# Altium schematic sheet VESC6.SchDoc
size A4; SheetNumber: 1; SheetTotal: 8
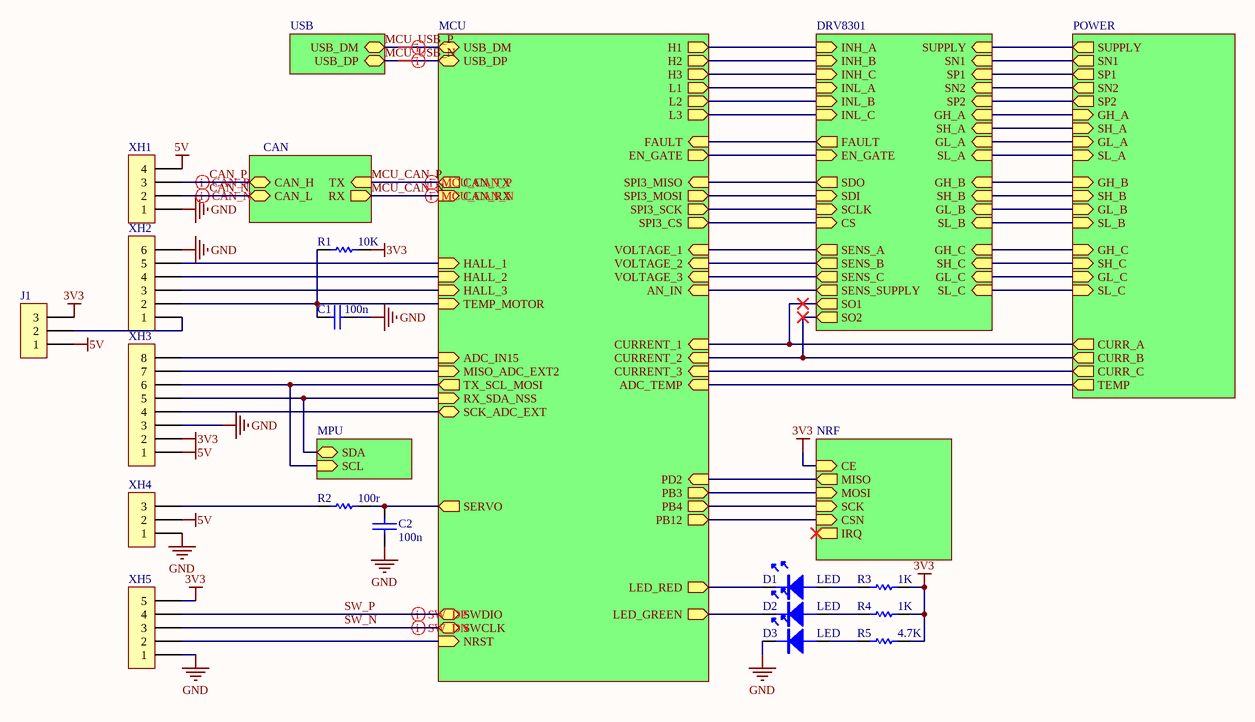
[diagram p0: VESC6.SchDoc]

## Parts
C1  100n  [0603C]
C2  100n  [0603C]
D1  LED  [LED-0603Y]
D2  LED  [LED-0603Y]
D3  LED  [LED-0603Y]
J1  Pin HDR1X3  [Pin HDR1X3/2.54mm-S]  (value not drawn)
R1  10K  [0603R]
R2  100r  [0603R]
R3  1K  [0603R]
R4  1K  [0603R]
R5  4.7K  [0603R]
XH1  XH4  [XH4/2.54mm/90]  (value not drawn)
XH2  XH6  [XH6/2.54mm/90]  (value not drawn)
XH3  XH8  [XH8/2.54mm/90]  (value not drawn)
XH4  XH3  [XH3/2.54mm/90]  (value not drawn)
XH5  XH5  [XH5/2.54mm/90]  (value not drawn)

## Sub-sheets
CAN = can: TX (in), RX (out), CAN_H (bidir), CAN_L (bidir)
DRV8301 = drv8301.SchDoc: INH_A (in), INH_B (in), INH_C (in), INL_A (in), INL_B (in), INL_C (in), FAULT (out), EN_GATE (in), SDO (out), SDI (in), SCLK (in), CS (in), SENS_A (out), SENS_B (out), SENS_C (out), SENS_SUPPLY (out), SUPPLY (in), GH_A (in), SH_A (in), GL_A (in), SL_A (in), GH_B (in), SH_B (in), GL_B (in), SL_B (in), GH_C (in), SH_C (in), GL_C (in), SL_C (in), SN1 (in), SN2 (in), SP1 (in), SP2 (in), SO1 (out), SO2 (out)
MCU = MCU.SchDoc: H1 (out), H2 (out), H3 (out), L1 (out), L2 (out), L3 (out), FAULT (in), EN_GATE (out), SPI3_MISO (in), SPI3_MOSI (out), SPI3_SCK (out), SPI3_CS (out), VOLTAGE_1 (in), VOLTAGE_2 (in), VOLTAGE_3 (in), AN_IN (in), CURRENT_1 (in), CURRENT_2 (in), CURRENT_3 (in), ADC_TEMP (in), PD2 (in), PB3 (out), PB4 (out), PB12 (out), LED_RED (out), LED_GREEN (out), USB_DM (bidir), USB_DP (bidir), CAN_TX (out), CAN_RX (in), HALL_1 (in), HALL_2 (in), HALL_3 (in), TEMP_MOTOR (in), ADC_IN15 (in), MISO_ADC_EXT2 (in), TX_SCL_MOSI (out), RX_SDA_NSS (in), SCK_ADC_EXT (bidir), SERVO (out), SWCLK (bidir), SWDIO (bidir), NRST (in)
MPU = mpu: SCL (in), SDA (bidir)
NRF = nrf.schdoc: MISO (out), MOSI (in), SCK (in), CSN (in), IRQ (out), CE (in)
POWER = power: SUPPLY (out), GH_A (in), SH_A (in), GL_A (in), SL_A (in), GH_B (in), SH_B (in), GL_B (in), SL_B (in), GH_C (in), SH_C (in), GL_C (in), SL_C (in), CURR_A (out), CURR_B (out), CURR_C (out), TEMP (out), SN1 (out), SN2 (out), SP1 (out), SP2 (out)
USB = USB: USB_DM (bidir), USB_DP (bidir)

## Nets
3V3: J1.3 R1.2 R3.2 R4.2 R5.2 XH3.2 XH5.5 ; sheet NRF/CE
5V: J1.1 XH1.4 XH3.1 XH4.2
GND: C1.2 C2.1 D3.K XH1.1 XH2.6 XH3.3 XH4.1 XH5.1
CAN_N: XH1.2 ; sheet CAN/CAN_L
CAN_P: XH1.3 ; sheet CAN/CAN_H
MCU_CAN_N: sheet MCU/CAN_RX, sheet CAN/RX
MCU_CAN_P: sheet MCU/CAN_TX, sheet CAN/TX
MCU_USB_N: sheet MCU/USB_DP, sheet USB/USB_DP
MCU_USB_P: sheet MCU/USB_DM, sheet USB/USB_DM
SW_N: XH5.3 ; sheet MCU/SWCLK
SW_P: XH5.4 ; sheet MCU/SWDIO
NetC1_1: C1.1 R1.1 XH2.2 ; sheet MCU/TEMP_MOTOR
NetC2_2: C2.2 R2.2 ; sheet MCU/SERVO
NetD1_A: D1.A R3.1
NetD1_K: D1.K ; sheet MCU/LED_RED
NetD2_A: D2.A R4.1
NetD2_K: D2.K ; sheet MCU/LED_GREEN
NetD3_A: D3.A R5.1
NetJ1_2: J1.2 XH2.1
NetR2_1: R2.1 XH4.3
NetXH2_3: XH2.3 ; sheet MCU/HALL_3
NetXH2_4: XH2.4 ; sheet MCU/HALL_2
NetXH2_5: XH2.5 ; sheet MCU/HALL_1
NetXH3_4: XH3.4 ; sheet MCU/SCK_ADC_EXT
NetXH3_5: XH3.5 ; sheet MCU/RX_SDA_NSS, sheet MPU/SDA
NetXH3_6: XH3.6 ; sheet MCU/TX_SCL_MOSI, sheet MPU/SCL
NetXH3_7: XH3.7 ; sheet MCU/MISO_ADC_EXT2
NetXH3_8: XH3.8 ; sheet MCU/ADC_IN15
NetXH5_2: XH5.2 ; sheet MCU/NRST
(unnamed): sheet MCU/H1, sheet DRV8301/INH_A
(unnamed): sheet MCU/H2, sheet DRV8301/INH_B
(unnamed): sheet MCU/H3, sheet DRV8301/INH_C
(unnamed): sheet MCU/L1, sheet DRV8301/INL_A
(unnamed): sheet MCU/L2, sheet DRV8301/INL_B
(unnamed): sheet MCU/L3, sheet DRV8301/INL_C
(unnamed): sheet MCU/FAULT, sheet DRV8301/FAULT
(unnamed): sheet MCU/EN_GATE, sheet DRV8301/EN_GATE
(unnamed): sheet MCU/SPI3_MISO, sheet DRV8301/SDO
(unnamed): sheet MCU/SPI3_MOSI, sheet DRV8301/SDI
(unnamed): sheet MCU/SPI3_SCK, sheet DRV8301/SCLK
(unnamed): sheet MCU/SPI3_CS, sheet DRV8301/CS
(unnamed): sheet MCU/VOLTAGE_1, sheet DRV8301/SENS_A
(unnamed): sheet MCU/VOLTAGE_2, sheet DRV8301/SENS_B
(unnamed): sheet MCU/VOLTAGE_3, sheet DRV8301/SENS_C
(unnamed): sheet MCU/AN_IN, sheet DRV8301/SENS_SUPPLY
(unnamed): sheet MCU/CURRENT_1, sheet DRV8301/SO1, sheet POWER/CURR_A
(unnamed): sheet MCU/CURRENT_2, sheet DRV8301/SO2, sheet POWER/CURR_B
(unnamed): sheet MCU/CURRENT_3, sheet POWER/CURR_C
(unnamed): sheet MCU/ADC_TEMP, sheet POWER/TEMP
(unnamed): sheet MCU/PD2, sheet NRF/MISO
(unnamed): sheet MCU/PB3, sheet NRF/MOSI
(unnamed): sheet MCU/PB4, sheet NRF/SCK
(unnamed): sheet MCU/PB12, sheet NRF/CSN
(unnamed): sheet DRV8301/SUPPLY, sheet POWER/SUPPLY
(unnamed): sheet DRV8301/GH_A, sheet POWER/GH_A
(unnamed): sheet DRV8301/SH_A, sheet POWER/SH_A
(unnamed): sheet DRV8301/GL_A, sheet POWER/GL_A
(unnamed): sheet DRV8301/SL_A, sheet POWER/SL_A
(unnamed): sheet DRV8301/GH_B, sheet POWER/GH_B
(unnamed): sheet DRV8301/SH_B, sheet POWER/SH_B
(unnamed): sheet DRV8301/GL_B, sheet POWER/GL_B
(unnamed): sheet DRV8301/SL_B, sheet POWER/SL_B
(unnamed): sheet DRV8301/GH_C, sheet POWER/GH_C
(unnamed): sheet DRV8301/SH_C, sheet POWER/SH_C
(unnamed): sheet DRV8301/GL_C, sheet POWER/GL_C
(unnamed): sheet DRV8301/SL_C, sheet POWER/SL_C
(unnamed): sheet DRV8301/SN1, sheet POWER/SN1
(unnamed): sheet DRV8301/SN2, sheet POWER/SN2
(unnamed): sheet DRV8301/SP1, sheet POWER/SP1
(unnamed): sheet DRV8301/SP2, sheet POWER/SP2

## Layout directives
differential pair: CAN_N, CAN_P, MCU_CAN_N, MCU_CAN_P, MCU_USB_N, MCU_USB_P, SW_N, SW_P

## Library data of the parts
C1 C2 = CAP: 无极性电容
R1-R5 = RES